# Altium schematic sheet Sheet1.SchDoc
size A4
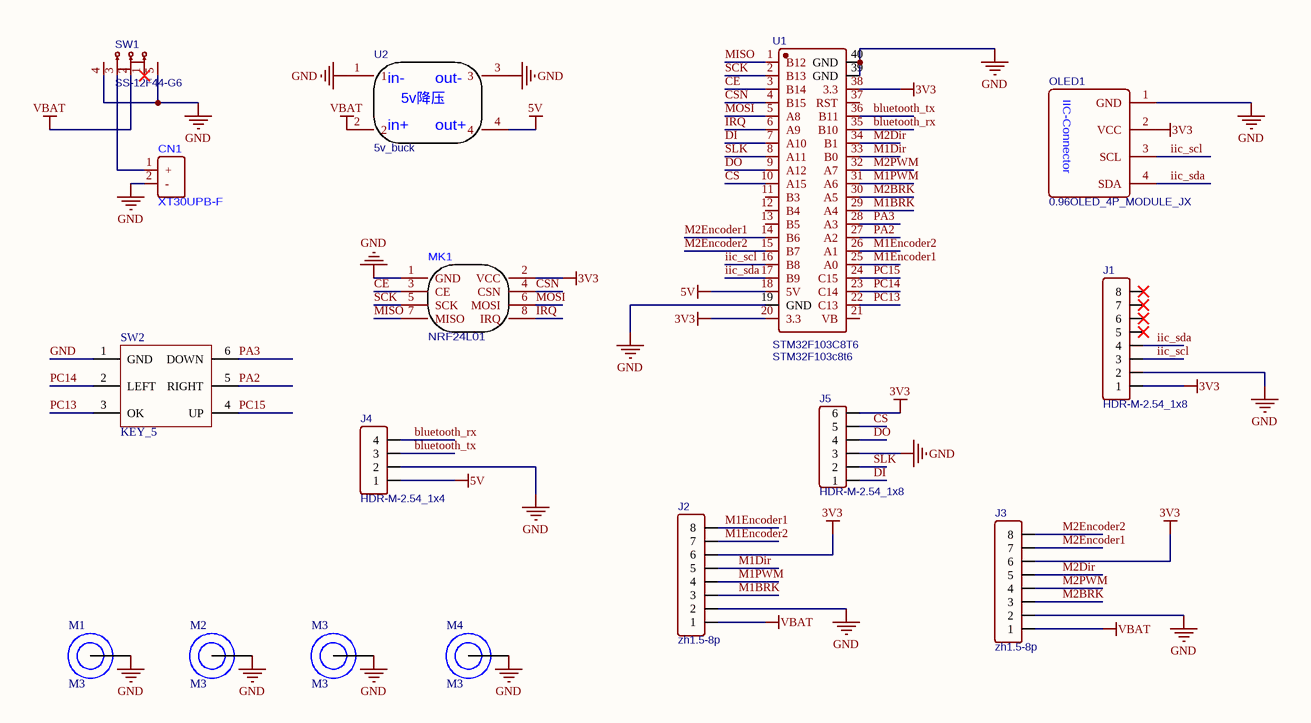
[diagram p0: Sheet1.SchDoc]

## Parts
CN1  XT30UPB-F  [XT30]
J1  HDR-M-2.54_1x8  [HDR-M-2.54_1X8]
J2  zh1.5-8p  [ZH1.5-8P]
J3  zh1.5-8p  [ZH1.5-8P]
J4  HDR-M-2.54_1x4  [HDR-M-2.54_1X4]
J5  HDR-M-2.54_1x8  [HDR-M-2.54_1X6]
M1  M3  [M3]
M2  M3  [M3]
M3  M3  [M3]
M4  M3  [M3]
MK1  NRF24L01  [NRF24L01]
OLED1  0.96OLED_4P_MODULE_JX  [0.96OLED_4P]
SW1  SS-12F44-G6  [SW-TH_SS-12F44-GX]
SW2  KEY_5  [KEY_5]
U1  STM32F103c8t6  [stm32f103coreboard]
U2  5v_buck  [5V_BUCK]

## Nets
3V3: J1.1 J2.6 J3.6 J5.6 MK1.2(VCC) OLED1.2(VCC) U1.20(3.3) U1.38(3.3)
5V: J4.1 U1.18(5V) U2.4
GND: CN1.2(-) J1.2 J2.2 J3.2 J4.2 J5.3 M1.1 M2.1 M3.1 M4.1 MK1.1(GND) OLED1.1(GND) SW1.4 SW1.5 SW2.1(GND) U1.19(GND) U1.39(GND) U1.40(GND) U2.1 U2.3
VBAT: J2.1 J3.1 SW1.2 U2.2
bluetooth_rx: J4.4 U1.35(B10)
bluetooth_tx: J4.3 U1.36(B11)
CE: MK1.3(CE) U1.3(B14)
CS: J5.5 U1.10(A15)
CSN: MK1.4(CSN) U1.4(B15)
DI: J5.1 U1.7(A10)
DO: J5.4 U1.9(A12)
iic_scl: J1.3 OLED1.3(SCL) U1.16(B8)
iic_sda: J1.4 OLED1.4(SDA) U1.17(B9)
IRQ: MK1.8(IRQ) U1.6(A9)
M1BRK: J2.3 U1.29(A4)
M1Dir: J2.5 U1.33(B0)
M1Encoder1: J2.8 U1.25(A0)
M1Encoder2: J2.7 U1.26(A1)
M1PWM: J2.4 U1.31(A6)
M2BRK: J3.3 U1.30(A5)
M2Dir: J3.5 U1.34(B1)
M2Encoder1: J3.7 U1.14(B6)
M2Encoder2: J3.8 U1.15(B7)
M2PWM: J3.4 U1.32(A7)
MISO: MK1.7(MISO) U1.1(B12)
MOSI: MK1.6(MOSI) U1.5(A8)
PA2: SW2.5(RIGHT) U1.27(A2)
PA3: SW2.6(DOWN) U1.28(A3)
PC13: SW2.3(OK) U1.22(C13)
PC14: SW2.2(LEFT) U1.23(C14)
PC15: SW2.4(UP) U1.24(C15)
SCK: MK1.5(SCK) U1.2(B13)
SLK: J5.2 U1.8(A11)
NetCN1_1: CN1.1(+) SW1.3

Not connected (* = marked no-connect by the designer): J1 5* 6* 7* 8*; SW1 1*; U1 11(B3) 12(B4) 13(B5) 21(VB) 37(RST)

## Notes on the sheet
- (in symbol 0.96OLED_4P_MODULE_JX) IIC-Connector
- (in symbol 5v_buck) in-; out-; 5v降压; in+; out+
- (in symbol STM32F103c8t6) STM32F103C8T6

## Library data of the parts
CN1 = XT30
J1 = HDR-M-2.54_1x8: Contributor: LCEDA_Lib; BOM_Supplier Part: C190820; BOM_Supplier: LCSC; spicePre: J; spiceSymbolName: HDR-M-2.54_1x8
J2 J3 = zh1.5-8p: Contributor: LCEDA_Lib; BOM_Supplier Part: C190820; BOM_Supplier: LCSC; spicePre: J; spiceSymbolName: HDR-M-2.54_1x8
J4 = HDR-M-2.54_1x4: Contributor: LCEDA_Lib; BOM_Supplier Part: C124378; BOM_Supplier: LCSC; spicePre: J; spiceSymbolName: HDR-M-2.54_1x4
J5 = HDR-M-2.54_1x6: Contributor: LCEDA_Lib; BOM_Supplier Part: C190820; BOM_Supplier: LCSC; spicePre: J; spiceSymbolName: HDR-M-2.54_1x8
OLED1 = 0.96OLED_4P_MODULE_JX: BOM_Manufacturer: null; Contributor: LCSC; BOM_Supplier: LCSC; BOM_Supplier Part: C9900004566; BOM_Manufacturer Part: 0.96OLED_4P_MODULE_JX; BOM_JLCPCB Part Class: Extended Part; spicePre: O; spiceSymbolName: 0.96OLED_4P_MODULE_JX
SW1 = SS-12F44-G6: BOM_Manufacturer: USAKRO; Contributor: LCSC; BOM_Supplier: LCSC; BOM_Supplier Part: C698210; BOM_Manufacturer Part: SS-12F44-G6; BOM_JLCPCB Part Class: Extended Part; spicePre: S; spiceSymbolName: SS-12F44-G6
SW2 = KEY_5: 五向导航按钮
U1 = STM32F103c8t6: Contributor: fsxqn; Package Display: Yes; spicePre: U; spiceSymbolName: STM32F103c8t6最小系统板
U2 = 5v_buck: Contributor: fsxqn; spicePre: U; spiceSymbolName: 5v_buck